# Altium schematic sheet OpAmpISet.schdoc: Analog Amplifier
size A4; Organization: Altium Limited; Address1: L3, 12a Rodborough Rd; Address2: Frenchs Forest; Address3: NSW; Address4: Australia 2086; DocumentNumber: 1; SheetNumber: 1; SheetTotal: 1
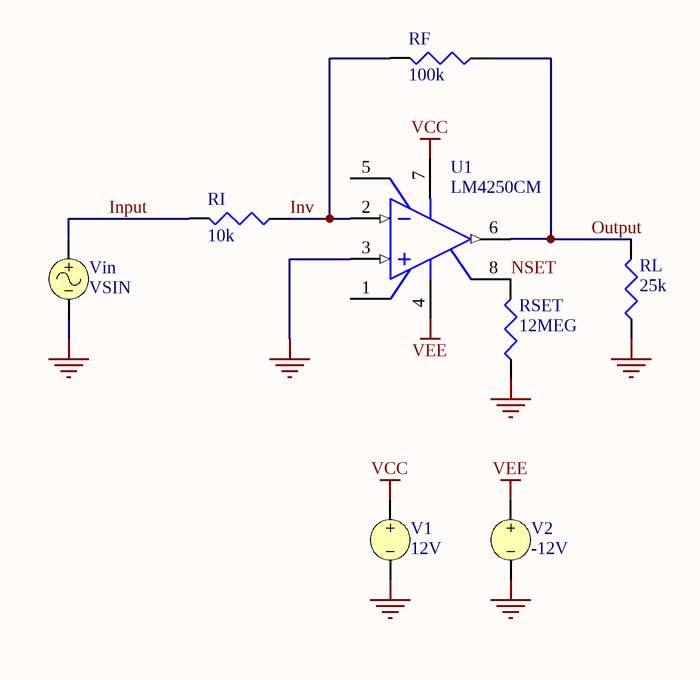
[diagram p0: OpAmpISet.schdoc]

## Parts
RF  100k
RI  10k
RL  25k
RSET  value 12MEG  (hidden comment: 25k)
U1  LM4250CM  [M08A_N]
V1  12V
V2  -12V
Vin  VSIN

## Nets
GND: RL.2(BOT) RSET.2(BOT) U1.3(IN+) V1.2 V2.2 Vin.2
VCC: U1.7(V+) V1.1
VEE: U1.4(V-) V2.1
Input: RI.1(TOP) Vin.1
Inv: RF.1(TOP) RI.2(BOT) U1.2(IN-)
NSET: RSET.1(TOP) U1.8(I_SET)
Output: RF.2(BOT) RL.1(TOP) U1.6(OUT)

Not connected (* = marked no-connect by the designer): U1 1(OFS_NULL) 5(OFS_NULL)

## Notes on the sheet
- Title
- Size:
- Date:
- A4
- Number:
- Time:
- Revision:
- Sheet
- of
- File:

## Library data of the parts
RF RI RL RSET = RES: Resistor
  RF: Value: 100k
  RI: Value: 10k
  RL: Value: 25k
U1 = LM4250CM: Programmable Operational Amplifier; Manufacturer: National Semiconductor; CompType: Amplifiers; PackageTopMarking: NSZXTT*LM42*50CM; Published: 4-Dec-2008; DatasheetVersion: Aug-2000; PackageVersion: revL, Sep-2006; PackageReference: M08A; Publisher: Altium Limited; PackageDescription: SOIC Narrow, 4.9 x 3.9 x 1.45mm, 8 Lead, 1.27mm Pitch; PartNumber: LM4250CM; RoHS: O; PinCount: 8; DigiKeyPartNumber: LM4250CM-ND; Code_JEDEC: MS-012-AA; Code_IPC: SOIC127P600-8; ComponentLink1Description: LM4250 Datasheet; ComponentLink1URL: http://www.national.com/ds/LM/LM4250.pdf; ComponentLink2Description: LM4250 Web Page; ComponentLink2URL: http://www.national.com/pf/LM/LM4250.html; ComponentLink3Description: M08A Package Page; ComponentLink3URL: http://www.national.com/packaging/folders/m08a.html; DeviceFunction: Amplifier
V1 V2 = VSRC: Voltage Source
  V1: Value: 12V
  V2: Value: -12V
Vin = VSIN: Sinusoidal Voltage Source